# EAGLE design astable 555 timer phase 1 (EAGLE 9.6.2)
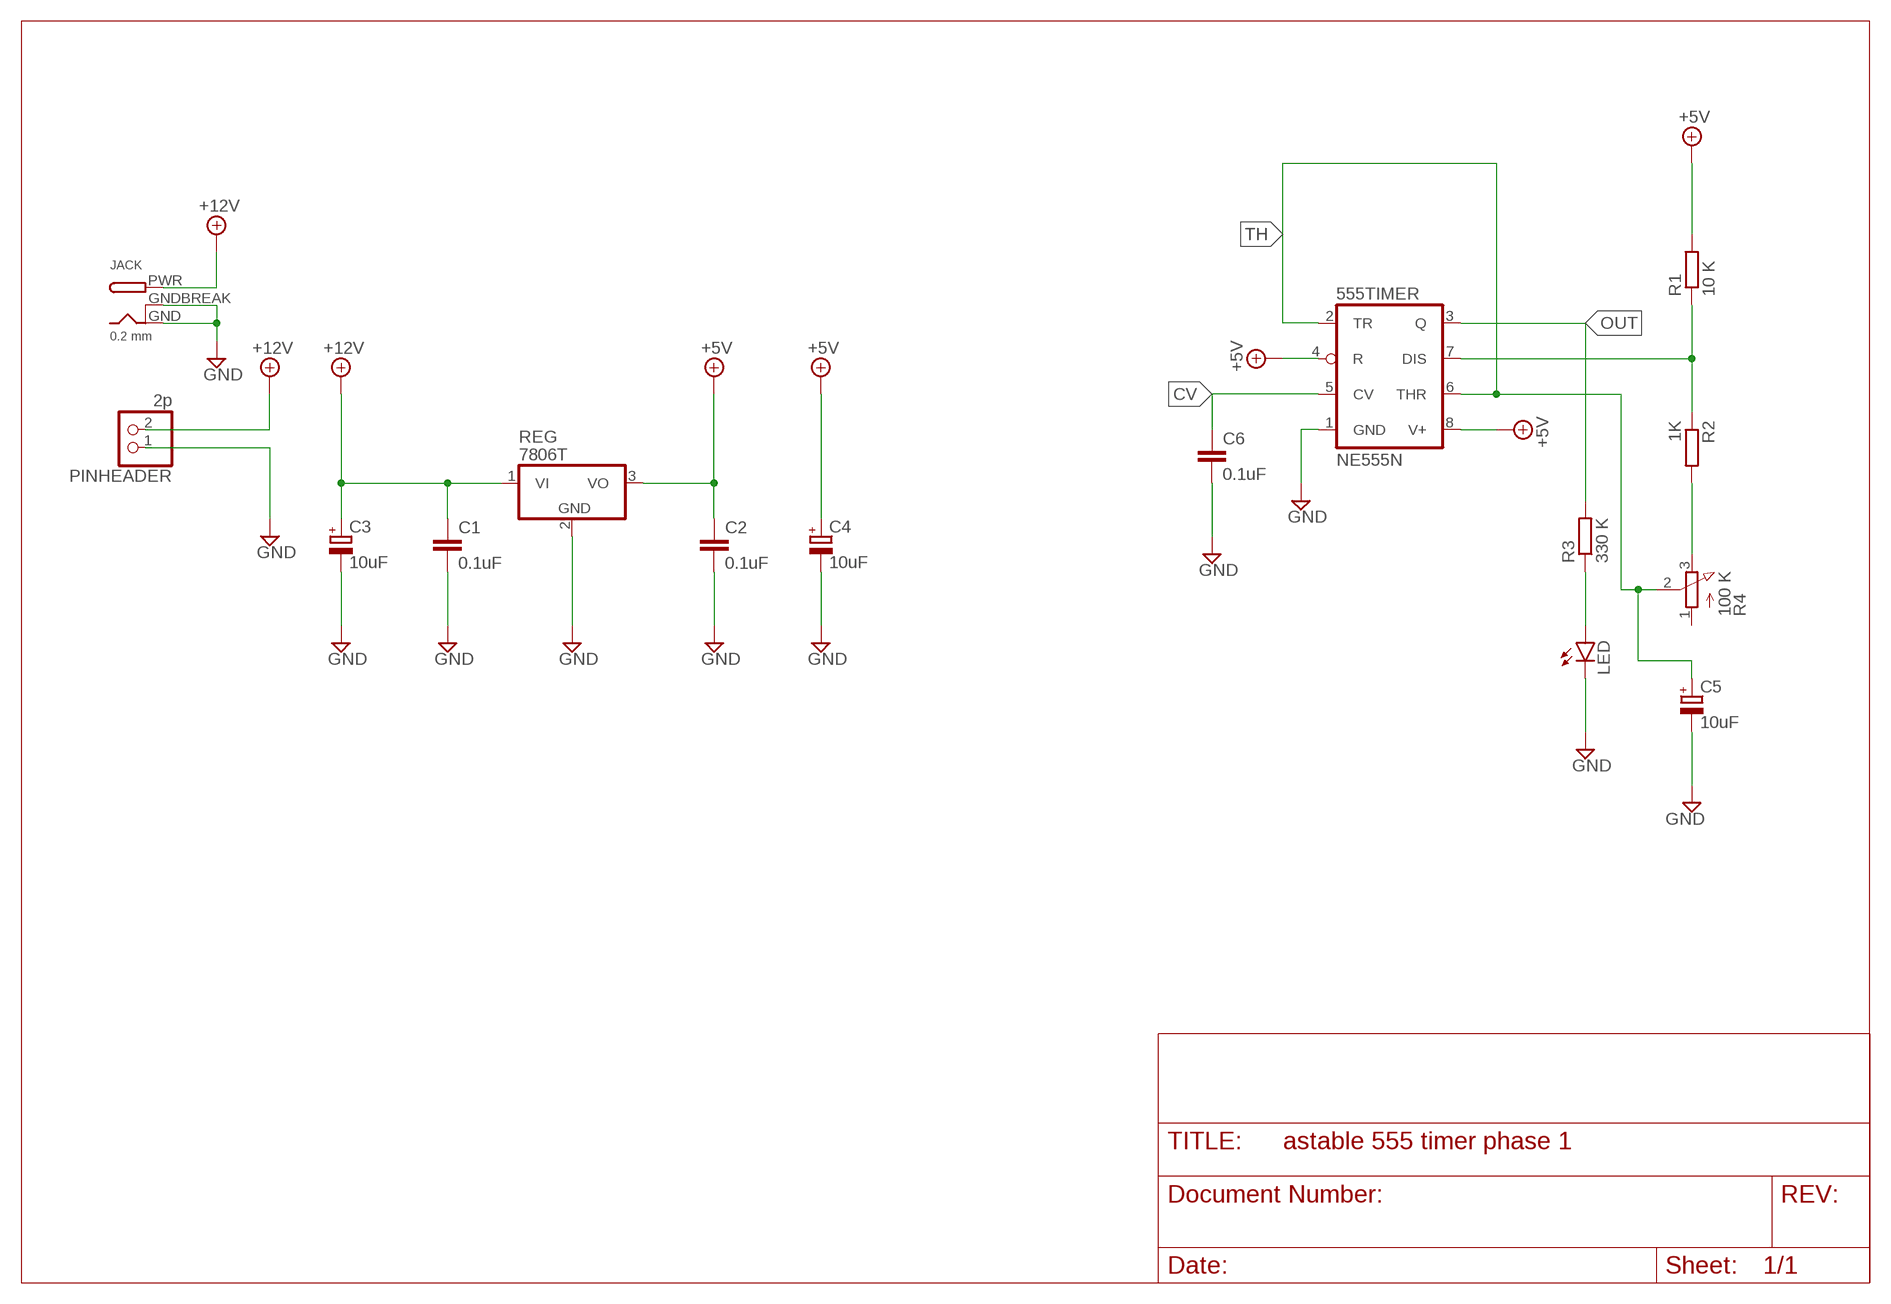
[diagram p0: schematic, sheet 1]

## Parts
555TIMER  NE555N  [DIL08]
C1  0.1uF  C-EU050-030X075  [C050-030X075]
C2  0.1uF  C-EU050-030X075  [C050-030X075]
C3  10uF  CPOL-EUE3.5-8  [E3,5-8]
C4  10uF  CPOL-EUE3.5-8  [E3,5-8]
C5  10uF  CPOL-EUE3.5-8  [E3,5-8]
C6  0.1uF  C-EU050-030X075  [C050-030X075]
JACK  0.2 mm  DCBARRELPTH  [DCJACK_2MM_PTH]
LED  LED5MM  [LED5MM]
PINHEADER  2p  PINHD-1X2  [1X02]
R1  10 K  R-EU_0207/10  [0207/10]
R2  1K  R-EU_0207/10  [0207/10]
R3  330 K  R-EU_0207/10  [0207/10]
R4  100 K  3RP/1610N  [3RP/1610N]
REG  7806T  [TO220H]

## Nets
+5V [power]: 555TIMER.4(R) 555TIMER.8(V+) C2.1 C4.+ R1.2 REG.3(VO)
+12V [power]: C1.1 C3.+ JACK.PWR PINHEADER.2 REG.1(VI)
CV: 555TIMER.5(CV) C6.1
GND [power]: 555TIMER.1(GND) C1.2 C2.2 C3.- C4.- C5.- C6.2 JACK.GND JACK.GNDBREAK LED.K(C) PINHEADER.1 REG.2(GND)
N$2: 555TIMER.7(DIS) R1.1 R2.1
N$3: R2.2 R4.3(E)
N$4: LED.A R3.1
OUT: 555TIMER.3(Q) R3.2
TH: 555TIMER.2(TR) 555TIMER.6(THR) C5.+ R4.2(S)
Unconnected: R4.1(A)

## Library data of the parts
555TIMER = linear:*555: TIMER
C1 C2 C6 = rcl:C-EU: CAPACITOR, European symbol; SPICEPREFIX: C
C3-C5 = rcl:CPOL-EU: POLARIZED CAPACITOR, European symbol; SPICEPREFIX: C
JACK = adafruit:DCBARREL: 2.0mm DC Barrel Jack DCJACK_2MM_PTH - Through Hole Jack (4UConnector: 05537)
LED = led:LED: LED OSRAM: - CHIPLED LG R971, LG N971, LY N971, LG Q971, LY Q971, LO R971, LY R971 LH N974, LH R974 LS Q976, LO Q976, LY Q976 LO Q996 - Hyper CHIPLED LW Q18S LB Q993, LB Q99A, LB R99A - SideLED LS A670, LO A670, LY A670, LG A670, LP A670 LB A673, LV A673, LT A673, LW A673 LH A674 LY A675 LS A676, LA A676, LO A676, LY A676, LW A676 LS A679, LY A679, LG A679 - Hyper Micro SIDELED® LS Y876, LA Y876, LO Y876, LY Y876 LT Y87S - SmartLED LW L88C, LW L88S LB L89C, LB L89S, LG L890 LS L89K, LO L89K, LY L89K LS L896, LA L896, LO L896, LY L896 - TOPLED LS T670, LO T670, LY T670, LG T670, LP T670 LSG T670, LSP T670, LSY T670, LOP T670, LYG T670 LG T671, LOG T671, LSG T671 LB T673, LV T673, LT T673, LW T673 LH T674 LS T676, LA T676, LO T676, LY T676, LB T676, LH T676, LSB T676, LW T676 LB T67C, LV T67C, LT T67C, LS T67K, LO T67K, LY T67K, LW E67C LS E67B, LA E67B, LO E67B, LY E67B, LB E67C, LV E67C, LT E67C LW T67C LS T679, LY T679, LG T679 LS T770, LO T770, LY T770, LG T770, LP T770 LB T773, LV T773, LT T773, LW T773 LH T774 LS E675, LA E675, LY E675, LS T675 LS T776, LA T776, LO T776, LY T776, LB T776 LHGB T686 LT T68C, LB T68C - Hyper Mini TOPLED® LB M676 - Mini TOPLED Santana® LG M470 LS M47K, LO M47K, LY M47K Source: http://www.osram.convergy.de LUXEON: - LUMILED® LXK2-PW12-R00, LXK2-PW12-S00, LXK2-PW14-U00, LXK2-PW14-V00 LXK2-PM12-R00, LXK2-PM12-S00, LXK2-PM14-U00 LXK2-PE12-Q00, LXK2-PE12-R00, LXK2-PE12-S00, LXK2-PE14-T00, LXK2-PE14-U00 LXK2-PB12-K00, LXK2-PB12-L00, LXK2-PB12-M00, LXK2-PB14-N00, LXK2-PB14-P00, LXK2-PB14-Q00 LXK2-PR12-L00, LXK2-PR12-M00, LXK2-PR14-Q00, LXK2-PR14-R00 LXK2-PD12-Q00, LXK2-PD12-R00, LXK2-PD12-S00 LXK2-PH12-R00, LXK2-PH12-S00 LXK2-PL12-P00, LXK2-PL12-Q00, LXK2-PL12-R00 Source: www.luxeon.com KINGBRIGHT: KA-3528ASYC Source: www.kingbright.com
PINHEADER = pinhead:PINHD-1X2: PIN HEADER
R1-R3 = rcl:R-EU_: RESISTOR, European symbol; SPICEPREFIX: R
R4 = pot:3RP/1610N: 16mm Potentiometer one level Source: http://www.alphapotentiometers.net/html/16mm_pot_2.html
REG = linear:78*: Positive VOLTAGE REGULATOR Source: http://cache.national.com/ds/LM/LM78L05.pdf http://www.fairchildsemi.com/ds/LM/LM7805.pdf

## Net classes
0 default: width 0.305 mm, drill 0.305 mm, clearance 0.254 mm
1 power: width 0.406 mm, drill 0.406 mm, clearance 0.305 mm

## Board
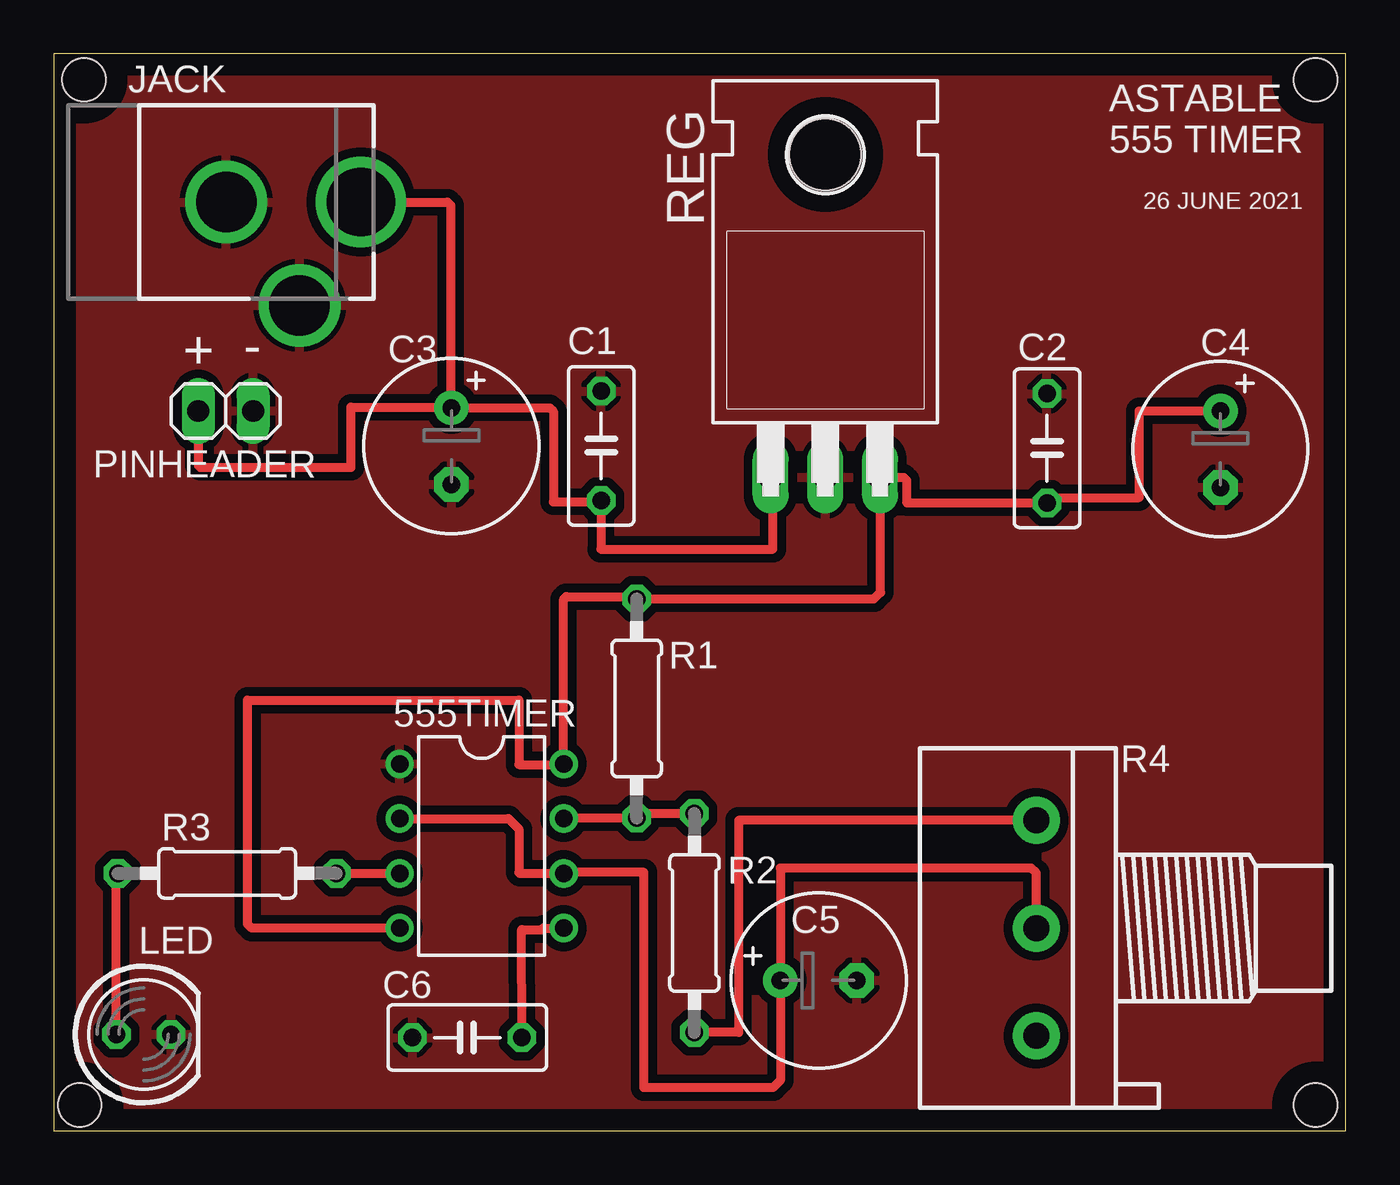
[diagram p1: board, top side]

Size 60 x 50 mm. Coordinates in mm from the lower left corner, seen from the top.
Outline: 0,0 60,0 60,50 0,50 0,0
Copper layers (1*16): Top 0.035mm / dielectric 1.5mm / Bottom 0.035mm
Design rules "default": minimum track width 6mil, minimum drill 0.35mm, track to track 6mil, track to pad 6mil, pad to pad 6mil, via to via 6mil, smd to smd 6mil, copper to edge 40mil, drill to drill 6mil, minimum pad ring 10mil, minimum via ring 8mil, stop-mask expansion 4mil, vias tented up to drill 0mil, thermal gap 10mil
Holes 2 mm at 1.4,48.8 58.6,48.8 58.6,1.2 1.2,1.2

### Footprints (pad centres in the part's own frame; a part is rotated, then mirrored left to right if it is on the bottom)
DIL08 = drill 0.813 pad 1.27: 1 -3.81,-3.81; 2 -1.27,-3.81; 3 1.27,-3.81; 4 3.81,-3.81; 5 3.81,3.81; 6 1.27,3.81; 7 -1.27,3.81; 8 -3.81,3.81
C050-030X075 = drill 0.813 octagon: 1 -2.54,0; 2 2.54,0
E3,5-8 = drill 0.813 pad 1.6: + -1.778,0 | drill 0.813 pad 1.6 octagon: - 1.778,0
DCJACK_2MM_PTH = drill 2.8: GND 0,7.35; GNDBREAK 4.8,10.75 | drill 3.2: PWR 0,13.6
LED5MM = drill 0.813 octagon: A -1.27,0; K 1.27,0
1X02 = drill 1.016 long: 1 -1.27,0; 2 1.27,0
0207/10 = drill 0.813 octagon: 1 -5.08,0; 2 5.08,0
3RP/1610N = drill 1.2 pad 2.184: 1 -5,0; 2 0,0; 3 5,0
TO220H = drill 1.118 long: 1 -2.54,-10.16; 2 0,-10.16; 3 2.54,-10.16 | hole 3.302: 0,4.826

### Placement (x,y rotation side)
555TIMER  19.87,13.22 270 top
C1  25.42,31.8 90 top
C2  46.13,31.69 90 top
C3  18.47,31.79 270 top
C4  54.18,31.65 270 top
C5  35.52,6.98 0 top
C6  19.2,4.33 180 top
JACK  0.66,43.12 270 top
LED  4.17,4.47 0 top
PINHEADER  7.98,33.42 180 top
R1  27.07,19.61 90 top
R2  29.75,9.65 270 top
R3  8.05,11.95 0 top
R4  45.63,9.41 90 top
REG  35.83,40.5 0 top

### Tracks (layer width: path | path; a pad name or v marks a point on that pad's centre or on a via)
+5V
  Top 0.406: C4.+ 50.41,33.43 50.41,29.41 50.4,29.4 46.38,29.4 C2.1 39.64,29.15 39.6,29.19 39.6,30.2 39.46,30.34 REG.3 38.4,30.31 38.4,25 38.09,24.69 R1.2 26.96,24.8 23.8,24.8 23.68,24.68 555TIMER.8 23.65,17 21.6,17 21.6,20 9,20 9,9.6 9.19,9.41 555TIMER.4
+12V
  Top 0.406: PINHEADER.2 6.71,30.89 6.8,30.8 13.8,30.8 13.8,33.6 18.44,33.6 | 18.44,33.6 C3.+ 23.03,33.57 23.2,33.4 23.2,29.2 25.36,29.2 C1.1 | JACK.PWR 18.28,43.12 18.44,42.96 18.44,33.6 | 24.94,29.26 C1.1 | REG.1 33.29,30.29 33.4,30.18 33.4,27 25.4,27 25.42,27.02 C1.1
CV
  Top 0.406: C6.1 21.73,9.34 22.67,9.34 22.74,9.41 555TIMER.5
GND
  pour Top (isolate 0.406): 0.2,49.8 59.8,49.8 59.8,0.2 0.2,0.2
N$2
  Top 0.406: R2.1 27.27,14.73 R1.1 23.72,14.53 555TIMER.7
N$3
  Top 0.406: R4.3 31.81,14.41 31.8,14.4 31.8,4.57 R2.2
N$4
  Top 0.406: LED.A 2.9,11.88 R3.1
OUT
  Top 0.406: R3.2 555TIMER.3
TH
  Top 0.406: 555TIMER.2 21.11,14.49 21.6,14 21.6,12 21.65,11.95 555TIMER.6 23.73,12 27.4,12 27.4,2 33.4,2 33.74,2.34 C5.+ 33.74,12.2 45.4,12.2 45.63,11.97 R4.2 45.63,10.37

### Text on the board
tNames: ASTABLE / 555 TIMER | 26 JUNE 2021 | - | +